# EAGLE board MainBoardSchematic (EAGLE 7.2.0)
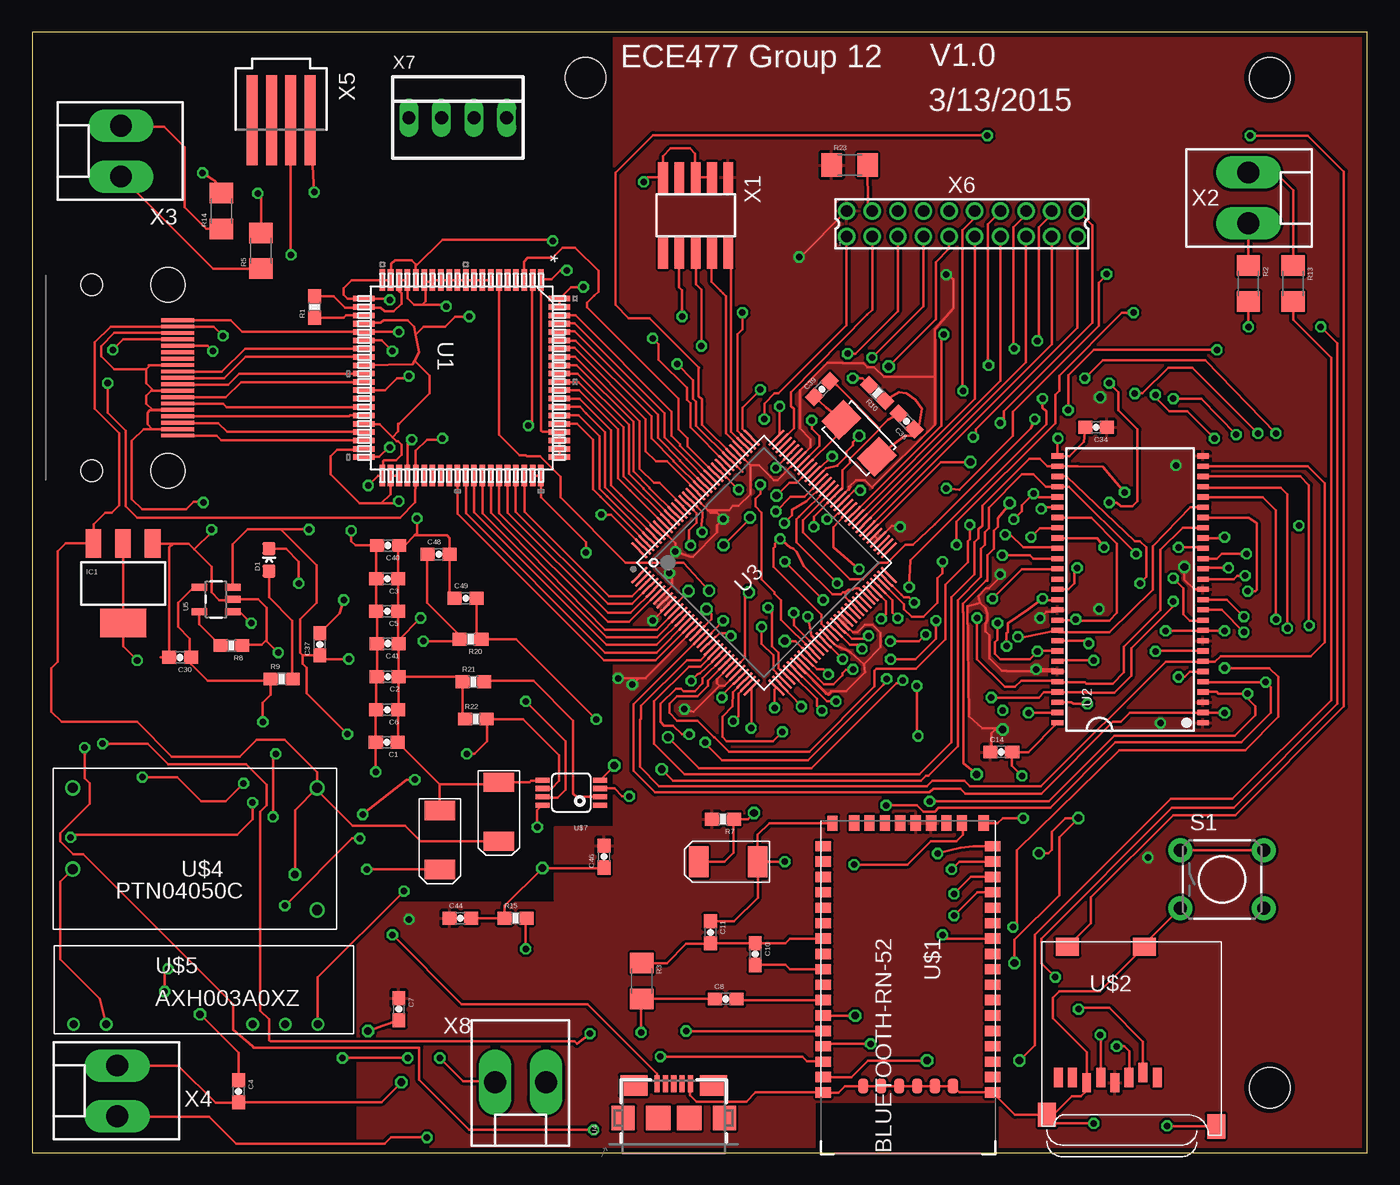
[diagram p5: board, top side]
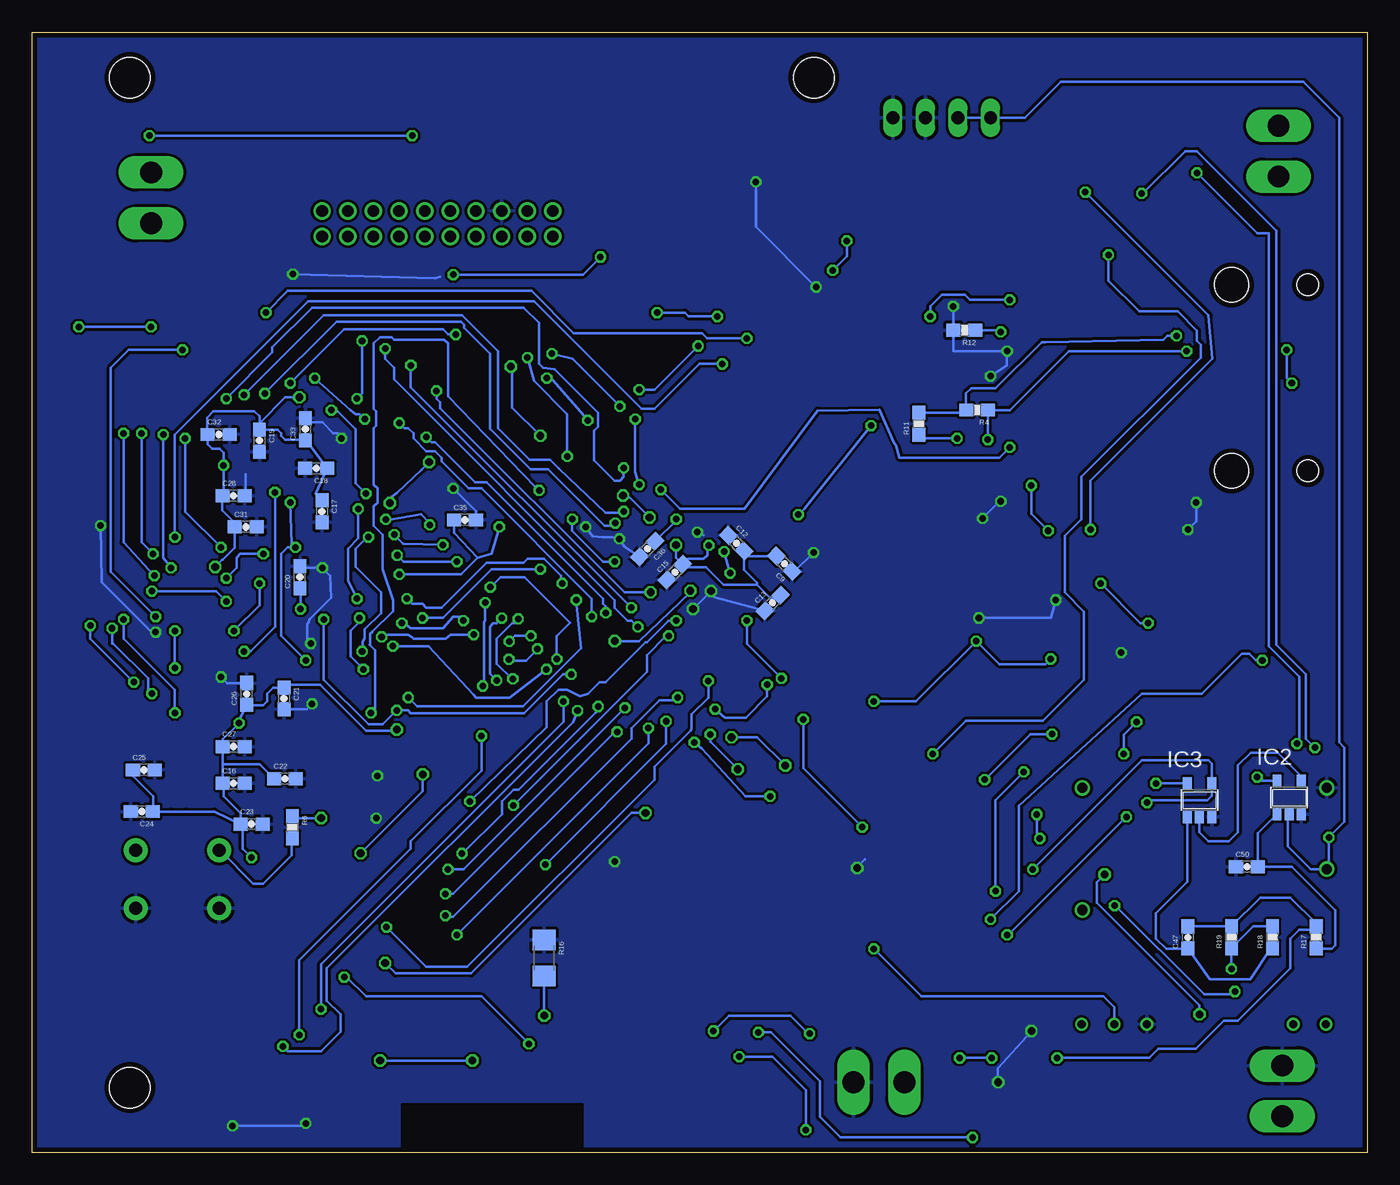
[diagram p6: board, bottom side, seen from below]

Size 104.14 x 87.38 mm. Coordinates in mm from the lower left corner, seen from the top.
Outline: 0,0 104.14,0 104.14,87.38 0,87.38 0,0
Copper layers (1*16): Top 0.0356mm / dielectric 1.5011mm / Bottom 0.0356mm
Design rules "ECE_Senior_Design": minimum track width 8mil, minimum drill 13mil, track to track 8mil, track to pad 8mil, pad to pad 6mil, via to via 8mil, smd to smd 6mil, copper to edge 15mil, drill to drill 8mil, minimum pad ring 7mil, minimum via ring 7mil, stop-mask expansion 3mil, vias tented up to drill 0mil, thermal gap 10mil
Holes 3.17 mm at 43.18,83.82 96.52,83.82 96.52,5.08
tRestrict: area 61.2,0 to 75.3,3.8
bRestrict: area 61.2,0 to 75.3,3.8

## Footprints (pad centres in the part's own frame; a part is rotated, then mirrored left to right if it is on the bottom)
0603-CAP = smd 1.1 x 1: 1 -0.85,0; 2 0.85,0
EIA6032 = smd 1.5 x 2.4: P$1 -2.3,0; P$2 2.3,0
LED-0603 = smd 1 x 1: A 0,-0.877; C 0,0.877
SOT223 = smd 1.219 x 2.235: 1 -2.311,-3.099; 2 0,-3.099; 3 2.311,-3.099 | smd 3.6 x 2.2: 4 0,3.099
SOT23-5 = smd 0.69 x 0.99: 1 -0.95,-1.29; 2 0,-1.29; 3 0.95,-1.29; 4 0.95,1.3; 5 -0.95,1.3
0603-RES = smd 1.1 x 1: 1 -0.85,0; 2 0.85,0
1206 = smd 1.6 x 1.8: 1 -1.4,0; 2 1.4,0
TACTILE-PTH = drill 1.016 pad 1.88: 1 -3.251,2.261; 2 3.251,2.261; 3 -3.251,-2.261; 4 3.251,-2.261
ST_80_2 = smd 1.676 x 0.432: 1 -7.62,6.172; 2 -7.62,5.537; 3 -7.62,4.877; 4 -7.62,4.216; 5 -7.62,3.581; 6 -7.62,2.921; 7 -7.62,2.286; 8 -7.62,1.626; 9 -7.62,0.965; 10 -7.62,0.33; 11 -7.62,-0.33; 12 -7.62,-0.965; 13 -7.62,-1.626; 14 -7.62,-2.286; 15 -7.62,-2.921; 16 -7.62,-3.581; 17 -7.62,-4.216; 18 -7.62,-4.877; 19 -7.62,-5.537; 20 -7.62,-6.172; 41 7.62,-6.172; 42 7.62,-5.537; 43 7.62,-4.877; 44 7.62,-4.216; 45 7.62,-3.581; 46 7.62,-2.921; 47 7.62,-2.286; 48 7.62,-1.626; 49 7.62,-0.965; 50 7.62,-0.33; 51 7.62,0.33; 52 7.62,0.965; 53 7.62,1.626; 54 7.62,2.286; 55 7.62,2.921; 56 7.62,3.581; 57 7.62,4.216; 58 7.62,4.877; 59 7.62,5.537; 60 7.62,6.172 | smd 0.432 x 1.676: 21 -6.172,-7.62; 22 -5.537,-7.62; 23 -4.877,-7.62; 24 -4.216,-7.62; 25 -3.581,-7.62; 26 -2.921,-7.62; 27 -2.286,-7.62; 28 -1.626,-7.62; 29 -0.965,-7.62; 30 -0.33,-7.62; 31 0.33,-7.62; 32 0.965,-7.62; 33 1.626,-7.62; 34 2.286,-7.62; 35 2.921,-7.62; 36 3.581,-7.62; 37 4.216,-7.62; 38 4.877,-7.62; 39 5.537,-7.62; 40 6.172,-7.62; 61 6.172,7.62; 62 5.537,7.62; 63 4.877,7.62; 64 4.216,7.62; 65 3.581,7.62; 66 2.921,7.62; 67 2.286,7.62; 68 1.626,7.62; 69 0.965,7.62; 70 0.33,7.62; 71 -0.33,7.62; 72 -0.965,7.62; 73 -1.626,7.62; 74 -2.286,7.62; 75 -2.921,7.62; 76 -3.581,7.62; 77 -4.216,7.62; 78 -4.877,7.62; 79 -5.537,7.62; 80 -6.172,7.62
TSOP54-400 = smd 0.4 x 0.9: 1 -10.4,-5.68; 2 -9.6,-5.68; 3 -8.8,-5.68; 4 -8,-5.68; 5 -7.2,-5.68; 6 -6.4,-5.68; 7 -5.6,-5.68; 8 -4.8,-5.68; 9 -4,-5.68; 10 -3.2,-5.68; 11 -2.4,-5.68; 12 -1.6,-5.68; 13 -0.8,-5.68; 14 0,-5.68; 15 0.8,-5.68; 16 1.6,-5.68; 17 2.4,-5.68; 18 3.2,-5.68; 19 4,-5.68; 20 4.8,-5.68; 21 5.6,-5.68; 22 6.4,-5.68; 23 7.2,-5.68; 24 8,-5.68; 25 8.8,-5.68; 26 9.6,-5.68; 27 10.4,-5.68; 28 10.4,5.68; 29 9.6,5.68; 30 8.8,5.68; 31 8,5.68; 32 7.2,5.68; 33 6.4,5.68; 34 5.6,5.68; 35 4.8,5.68; 36 4,5.68; 37 3.2,5.68; 38 2.4,5.68; 39 1.6,5.68; 40 0.8,5.68; 41 0,5.68; 42 -0.8,5.68; 43 -1.6,5.68; 44 -2.4,5.68; 45 -3.2,5.68; 46 -4,5.68; 47 -4.8,5.68; 48 -5.6,5.68; 49 -6.4,5.68; 50 -7.2,5.68; 51 -8,5.68; 52 -8.8,5.68; 53 -9.6,5.68; 54 -10.4,5.68
PDT0128A_N = smd 1.753 x 0.229: 1 -7.569,6.198; 2 -7.569,5.791; 3 -7.569,5.41; 4 -7.569,5.004; 5 -7.569,4.597; 6 -7.569,4.191; 7 -7.569,3.81; 8 -7.569,3.404; 9 -7.569,2.997; 10 -7.569,2.591; 11 -7.569,2.21; 12 -7.569,1.803; 13 -7.569,1.397; 14 -7.569,0.991; 15 -7.569,0.61; 16 -7.569,0.203; 17 -7.569,-0.203; 18 -7.569,-0.61; 19 -7.569,-0.991; 20 -7.569,-1.397; 21 -7.569,-1.803; 22 -7.569,-2.21; 23 -7.569,-2.591; 24 -7.569,-2.997; 25 -7.569,-3.404; 26 -7.569,-3.81; 27 -7.569,-4.191; 28 -7.569,-4.597; 29 -7.569,-5.004; 30 -7.569,-5.41; 31 -7.569,-5.791; 32 -7.569,-6.198; 65 7.569,-6.198; 66 7.569,-5.791; 67 7.569,-5.41; 68 7.569,-5.004; 69 7.569,-4.597; 70 7.569,-4.191; 71 7.569,-3.81; 72 7.569,-3.404; 73 7.569,-2.997; 74 7.569,-2.591; 75 7.569,-2.21; 76 7.569,-1.803; 77 7.569,-1.397; 78 7.569,-0.991; 79 7.569,-0.61; 80 7.569,-0.203; 81 7.569,0.203; 82 7.569,0.61; 83 7.569,0.991; 84 7.569,1.397; 85 7.569,1.803; 86 7.569,2.21; 87 7.569,2.591; 88 7.569,2.997; 89 7.569,3.404; 90 7.569,3.81; 91 7.569,4.191; 92 7.569,4.597; 93 7.569,5.004; 94 7.569,5.41; 95 7.569,5.791; 96 7.569,6.198 | smd 0.229 x 1.753: 33 -6.198,-7.569; 34 -5.791,-7.569; 35 -5.41,-7.569; 36 -5.004,-7.569; 37 -4.597,-7.569; 38 -4.191,-7.569; 39 -3.81,-7.569; 40 -3.404,-7.569; 41 -2.997,-7.569; 42 -2.591,-7.569; 43 -2.21,-7.569; 44 -1.803,-7.569; 45 -1.397,-7.569; 46 -0.991,-7.569; 47 -0.61,-7.569; 48 -0.203,-7.569; 49 0.203,-7.569; 50 0.61,-7.569; 51 0.991,-7.569; 52 1.397,-7.569; 53 1.803,-7.569; 54 2.21,-7.569; 55 2.591,-7.569; 56 2.997,-7.569; 57 3.404,-7.569; 58 3.81,-7.569; 59 4.191,-7.569; 60 4.597,-7.569; 61 5.004,-7.569; 62 5.41,-7.569; 63 5.791,-7.569; 64 6.198,-7.569; 97 6.198,7.569; 98 5.791,7.569; 99 5.41,7.569; 100 5.004,7.569; 101 4.597,7.569; 102 4.191,7.569; 103 3.81,7.569; 104 3.404,7.569; 105 2.997,7.569; 106 2.591,7.569; 107 2.21,7.569; 108 1.803,7.569; 109 1.397,7.569; 110 0.991,7.569; 111 0.61,7.569; 112 0.203,7.569; 113 -0.203,7.569; 114 -0.61,7.569; 115 -0.991,7.569; 116 -1.397,7.569; 117 -1.803,7.569; 118 -2.21,7.569; 119 -2.591,7.569; 120 -2.997,7.569; 121 -3.404,7.569; 122 -3.81,7.569; 123 -4.191,7.569; 124 -4.597,7.569; 125 -5.004,7.569; 126 -5.41,7.569; 127 -5.791,7.569; 128 -6.198,7.569
USB-AB-MICRO-SMD = smd 1.35 x 0.4: D+ 2.675,0; D- 2.675,0.65; GND 2.675,-1.3; ID 2.675,-0.65; VBUS 2.675,1.3 | smd 1.6 x 2.1: P$1 2.55,3.1; P$2 2.55,-3.1 | smd 1.9 x 1.9: P$6 0,1.2; P$7 0,-1.2 | smd 1.9 x 1.801: P$8 0,3.95; P$9 0,-3.95
SOT23-5' = smd 0.55 x 1.2: 1 -0.95,-1.3; 2 0,-1.3; 3 0.95,-1.3; 4 0.95,1.3; 5 -0.95,1.3
RN-52 = smd 1.2 x 0.8: 1 -6.6,8.33; 2 -6.6,7.13; 3 -6.6,5.93; 4 -6.6,4.73; 5 -6.6,3.53; 6 -6.6,2.33; 7 -6.6,1.13; 8 -6.6,-0.07; 9 -6.6,-1.27; 10 -6.6,-2.47; 11 -6.6,-3.67; 12 -6.6,-4.87; 13 -6.6,-6.07; 14 -6.6,-7.27; 15 -6.6,-8.47; 16 -6.6,-9.67; 25 6.6,-9.67; 26 6.6,-8.47; 27 6.6,-7.27; 28 6.6,-6.07; 29 6.6,-4.87; 30 6.6,-3.67; 31 6.6,-2.47; 32 6.6,-1.27; 33 6.6,-0.07; 34 6.6,1.13; 35 6.6,2.33; 36 6.6,3.53; 37 6.6,4.73; 38 6.6,5.93; 39 6.6,7.13; 40 6.6,8.33; G1 -6.6,9.53; G4 6.6,9.53 | smd 0.8 x 1.2: 17 -4.2,-11.47; 18 -3,-11.47; 19 -1.8,-11.47; 20 -0.6,-11.47; 21 0.6,-11.47; 22 1.8,-11.47; 23 3,-11.47; 24 4.2,-11.47; G2 -5.9,-11.47; G3 5.9,-11.46; RFG1 -3.5,9.03; RFG2 -2.1,9.03; RFG3 -0.7,9.03; RFG4 0.7,9.03; RFG5 2.1,9.03; RFG6 3.5,9.03
MICROSD = smd 0.7 x 1.5: 1 9,-10.64; 2 7.9,-10.24; 3 6.8,-10.64; 4 5.7,-11.04; 5 4.6,-10.64; 6 3.5,-11.04; 7 2.4,-10.64; 8 1.3,-10.64 | smd 1.8 x 1.4: CD1 2,-0.44; CD2 8,-0.44 | smd 1.4 x 1.9: MT1 0.4,-13.54; MT2 13.6,-14.44
HDMI_A_SMD = smd 0.3 x 2.6: P$1 4.5,3.74; P$2 4,3.74; P$3 3.5,3.74; P$4 3,3.74; P$5 2.5,3.74; P$6 2,3.74; P$7 1.5,3.74; P$8 1,3.74; P$9 0.5,3.74; P$10 0,3.74; P$11 -0.5,3.74; P$12 -1,3.74; P$13 -1.5,3.74; P$14 -2,3.74; P$15 -2.5,3.74; P$16 -3,3.74; P$17 -3.5,3.74; P$18 -4,3.74; P$19 -4.5,3.74 | hole 2.7: -7.25,2.98; 7.25,2.98 | hole 1.7: -7.25,-2.98; 7.25,-2.98
PTN04050C = drill 0.8: P$1 -9.53,4.76; P$2 9.53,4.76; P$3 9.53,-4.76; P$4 -9.53,-1.58
AXH003A0XZ = drill 0.635: P$1 -10.16,-2.667; P$2 -7.62,-2.667; P$3 3.81,-2.667; P$4 6.35,-2.667; P$5 8.89,-2.667
MSOP8 = smd 0.4 x 1.1: 1 -0.975,-2.25; 2 -0.325,-2.25; 3 0.325,-2.25; 4 0.975,-2.25; 5 0.975,2.25; 6 0.325,2.25; 7 -0.325,2.25; 8 -0.975,2.25
1365-10 = smd 0.76 x 2.4: 1 -2.54,-2.95; 2 -2.54,2.95; 3 -1.27,-2.95; 4 -1.27,2.95; 5 0,-2.95; 6 0,2.95; 7 1.27,-2.95; 8 1.27,2.95; 9 2.54,-2.95; 10 2.54,2.95
KK-156-2 = drill 1.7 pad 2.184 long: 1 -1.98,0; 2 1.98,0
87438-04 = smd 7 x 0.85: 1 0,2.25; 2 0,0.75; 3 0,-0.75; 4 0,-2.25
87758-2016 = drill 0.9 pad 1.27: 1 -9,-1; 2 -9,1; 3 -7,-1; 4 -7,1; 5 -5,-1; 6 -5,1; 7 -3,-1; 8 -3,1; 9 -1,-1; 10 -1,1; 11 1,-1; 12 1,1; 13 3,-1; 14 3,1; 15 5,-1; 16 5,1; 17 7,-1; 18 7,1; 19 9,-1; 20 9,1
22-23-2041 = drill 1 long: 1 -3.81,0; 2 -1.27,0; 3 1.27,0; 4 3.81,0
NX5032GA = smd 2 x 2.4: P$1 -2,0; P$2 2,0

## Placement (x,y rotation side)
C1  .1uF  [0603-CAP]  27.66,32.02 180 top
C2  .1uF  [0603-CAP]  27.74,37.12 180 top
C3  .1uF  [0603-CAP]  27.7,44.75 180 top
C4  10uF  [0603-CAP]  16.1,4.8 270 top
C5  .1uF  [0603-CAP]  27.69,42.23 180 top
C6  .1uF  [0603-CAP]  27.69,34.54 180 top
C7  10uF  [0603-CAP]  28.6,11.2 270 top
C8  47 nF  [0603-CAP]  54.1,12 0 top
C9  0.01 uF  [0603-CAP]  45.48,45.93 135 bottom
C10  47 nF  [0603-CAP]  56.4,15.5 270 top
C11  1uF  [0603-CAP]  52.9,17.2 270 top
C12  0.1 uF  [0603-CAP]  49.22,47.53 315 bottom
C13  1 uF  [0603-CAP]  46.39,42.88 45 bottom
C14  0.1uF  [0603-CAP]  75.58,31.25 0 top
C15  2.2 uF  [0603-CAP]  54.01,45.28 45 bottom
C16  0.1uF  [0603-CAP]  88.42,28.81 0 bottom
C17  0.01uF  [0603-CAP]  81.53,50.02 270 bottom
C18  0.01uF  [0603-CAP]  81.98,53.37 180 bottom
C19  0.1uF  [0603-CAP]  86.41,55.52 270 bottom
C20  0.1uF  [0603-CAP]  83.25,44.88 90 bottom
C21  0.1uF  [0603-CAP]  84.49,35.42 270 bottom
C22  0.1uF  [0603-CAP]  84.42,29.17 0 bottom
C23  0.1uF  [0603-CAP]  87.02,25.63 0 bottom
C24  0.1uF  [0603-CAP]  95.58,26.61 180 bottom
C25  0.1uF  [0603-CAP]  95.42,29.85 0 bottom
C26  0.1uF  [0603-CAP]  87.41,35.78 90 bottom
C27  0.01uF  [0603-CAP]  88.42,31.67 0 bottom
C28  0.1uF  [0603-CAP]  88.42,51.23 0 bottom
C29  10nF  [EIA6032]  54.29,22.69 0 top
C30  4.7uF  [0603-CAP]  11.55,38.63 180 top
C31  2.2 uF  [0603-CAP]  87.48,48.8 0 bottom
C32  2.2 uF  [0603-CAP]  89.58,56.01 0 bottom
C33  2.2 uF  [0603-CAP]  82.82,56.42 90 bottom
C34  2.2 uF  [0603-CAP]  82.98,56.57 180 top
C35  2.2 uF  [0603-CAP]  70.38,49.34 0 bottom
C36  2.2 uF  [0603-CAP]  56.15,47.08 225 bottom
C37  4.7uF  [0603-CAP]  22.44,39.65 90 top
C38  12pF  [0603-CAP]  68.19,57.02 135 top
C39  12pF  [0603-CAP]  61.6,59.54 45 top
C40  .1uF  [0603-CAP]  27.76,47.35 180 top
C41  .1uF  [0603-CAP]  27.74,39.7 180 top
C42  100 uF  [EIA6032]  31.8,24.4 90 top
C43  100 uF  [EIA6032]  36.4,26.6 90 top
C44  .1uF  [0603-CAP]  33.4,18.3 0 top
C46  4.7uF  [0603-CAP]  44.6,23.1 90 top
C47  1uF  [0603-CAP]  14,16.8 90 bottom
C48  1uF  [0603-CAP]  31.71,46.66 0 top
C49  220nF  [0603-CAP]  33.81,43.24 0 top
C50  1uF  [0603-CAP]  9.4,22.3 0 bottom
D1  RED  [LED-0603]  18.48,46.23 0 top
IC1  V_REG_LM1117SOT223  [SOT223]  7.1,44.4 180 top
IC2  NAND  [SOT23-5]  6.1,27.7 0 bottom
IC3  NAND  [SOT23-5]  13.1,27.5 0 bottom
R1  887  [0603-RES]  22.04,65.94 90 top
R2  8  [1206]  94.86,67.77 270 top
R3  2.2K  [1206]  47.55,13.4 270 top
R4  2k  [0603-RES]  30.44,57.92 180 bottom
R5  8  [1206]  17.85,70.33 90 top
R6  470  [0603-RES]  83.84,25.38 270 bottom
R7  10k  [0603-RES]  53.88,26.02 180 top
R8  10k  [0603-RES]  15.55,39.55 180 top
R9  10k  [0603-RES]  19.46,36.94 0 top
R10  750  [0603-RES]  65.91,59.24 135 top
R11  2k  [0603-RES]  34.99,56.84 90 bottom
R12  10k  [0603-RES]  31.44,64.13 180 bottom
R13  8  [1206]  98.34,67.77 270 top
R14  8  [1206]  14.77,73.43 90 top
R15  15k  [0603-RES]  37.7,18.3 0 top
R16  0  [1206]  64.2,15.2 270 bottom
R17  5M  [0603-RES]  4,16.8 90 bottom
R18  100k  [0603-RES]  7.4,16.8 90 bottom
R19  100k  [0603-RES]  10.6,16.8 90 bottom
R20  1k  [0603-RES]  34.19,40.05 180 top
R21  200k  [0603-RES]  34.41,36.73 0 top
R22  33m  [0603-RES]  34.61,33.82 0 top
R23  8  [1206]  63.76,77.01 0 top
S1  [TACTILE-PTH]  92.8,21.32 0 top
U1  HDMI TX  [ST_80_2]  33.5,60.42 270 top
U2  SDRAM  [TSOP54-400]  85.64,43.93 90 top
U3  Cortex M4  [PDT0128A_N]  57.09,46.01 45 top
U4  [USB-AB-MICRO-SMD]  50.04,2.71 90 top
U5  MCP73831  [SOT23-5']  14.35,43.15 90 top
U$1  BLUETOOTH-RN-52  [RN-52]  68.31,14.24 180 top
U$2  MICROSD  [MICROSD]  78.74,16.51 0 top
U$3  HDMI_A  [HDMI_A_SMD]  7.62,60.42 270 top
U$4  PTN04050C  [PTN04050C]  12.7,23.7 0 top
U$5  AXH003A0XZ  [AXH003A0XZ]  13.4,12.7 0 top
U$7  STC3100  [MSOP8]  42.05,28.08 90 top
X1  Cortex 10  [1365-10]  51.75,73.09 180 top
X2  [KK-156-2]  94.86,74.45 270 top
X3  [KK-156-2]  6.94,78.09 90 top
X4  [KK-156-2]  6.64,4.83 90 top
X5  87438-04  [87438-04]  19.43,80.5 270 top
X6  Camera HDR  [87758-2016]  72.52,72.43 0 top
X7  22-23-2041  [22-23-2041]  33.2,80.7 0 top
X8  [KK-156-2]  38.1,5.5 180 top
Y1  [NX5032GA]  64.49,55.71 133.9 top

## Tracks (layer width: path | path; a pad name or v marks a point on that pad's centre or on a via)
1.8V  (via drill 0.51 pad 0.25)
  Top 0.203: U1.29 29.68,61.48 29.84,61.76 | 29.84,61.76 30.2,62.4 29.92,63.78 | 29.92,63.78 29.8,64.4 29.3,64.9 27.4,64.9 27.2,64.7 25.94,64.7 U1.24 | v40.6,71.1 40.5,71.2 32,71.2 29.92,69.12 U1.16 29.92,69.28 29.6,69.6 28.3,69.6 28,69.3 28,68.08 U1.19 U1.20 24.94,68.04 24.3,67.4 24.3,66.9 24.6,66.6 U1.21 27.81,66.59 v27.9,66.5 | v41.7,68.8 41.2,68.8 40.5,68.1 39.73,68.1 U1.1 39.7,68.01 39.7,56.3 39.8,56.2 U1.64 U1.63 U1.62 U1.61 | v34.1,65.2 33,65.2 32.2,64.4 30.54,64.4 29.92,63.78 | v26.22,52.03 26.99,52.8 U1.41 27.38,52.85 27.38,53.92 27.47,54.01 28.4,54.01 28.8,54.41 28.8,55.2 28.54,55.46 28.44,55.46 28.1,55.8 | v24.89,48.5 24.89,47.7 25.23,47.36 C40.2 26.85,47.29 C3.2 C5.2 26.89,42.18 C41.2 C2.2 26.84,37.07 C6.2 26.81,34.51 C1.2 v26.8,29.7 | U$5.P$5 22.29,13.69 v29,20.4 | 29.84,61.76 31,60.6 31,59.2 28.64,56.84 28.54,56.84 28.54,56.24 28.1,55.8 | 28.1,55.8 27.1,56.8 25.92,56.8 U1.36
  Bottom 0.203: v40.6,71.1 40.6,69.9 v41.7,68.8 | v27.9,66.5 31,66.5 31.4,66.9 33.2,66.9 34.1,66 v34.1,65.2 | v26.22,52.03 26.22,49.83 v24.89,48.5 | v29,20.4 29,27.5 v26.8,29.7
3.3V  (via drill 0.51, 0.51 pad 0.25, 0.6)
  Top 0.203: 91.35,33.5 U2.1 91.29,33.5 | IC1.2 IC1.4 7.1,39.5 v8.2,38.4 | 32.45,18.2 C44.1 | U3.9 49.62,42.72 v48.4,41.5 | 49.04,48.66 U3.122 49.05,48.67 50.19,47.53 50.19,46.89 v50.17,46.87 51.36,46.48 51.53,46.48 53.43,48.38 53.43,48.93 v53.9,49.4 53.4,49.9 52.9,49.9 51.59,51.21 U3.113 52.72,50.1 54.34,50.1 54.67,50.43 55.1,50.43 56.01,51.34 56.01,53.59 | U3.101 56.01,53.59 | U3.69 U3.68 67.06,48.9 v67.7,48.8 | R7.2 53.03,25.63 | 54.4,37.96 U3.26 53.4,36.93 53.4,36.6 53.6,36.4 | 44.55,24 C46.2 | v89.86,45.68 89.86,44.69 90.62,43.93 U2.14 | C14.1 74.8,31.32 74.8,32.7 75.1,33 v75.7,33 75.61,33.09 74.11,33.09 73.05,34.05 72.95,42.6 73.74,42.79 73.9,42.89 | U3.28 54.99,37.39 54,36.4 53.6,36.4 | U3.7 49.05,43.35 49.9,44.2 49.9,45 v49.7,45.2 | v45.7,37 47.79,37 U3.16 51.59,40.76 47.84,37.01 47.32,37.01 v46.81,36.5 | v50.88,34.6 51.6,34.4 53.6,36.4 | 56.01,53.59 56.71,53.59 57.58,52.72 57.58,52.71 57.87,52.42 58.11,52.42 U3.90 60.71,55.02 60.71,55.65 59.88,56.48 59.88,59.45 62.02,61.59 63.2,61.59 63.23,61.56 64.84,61.56 65.14,61.26 65.67,61.26 66.44,60.49 70.3,60.49 70.39,60.4 | 64.86,38.09 64.96,37.47 63.46,35.97 62.34,35.97 62.18,35.81 61.92,35.81 59.77,37.96 U3.39 59.84,37.96 62.1,35.7 62.1,35.8 62.3,36 | 64.86,38.09 63.81,39.04 63.64,39.14 63.46,39.22 62.72,39.52 U3.47 | U2.43 79.93,42.33 79.8,42.2 79.1,42.2 v78.6,41.7 | v78.3,37.7 79.79,37.7 U2.49 76.07,37.53 76,37.6 75.63,37.6 74.67,38.56 74.67,40.36 74.36,40.67 74.36,41.26 74.52,41.52 74.52,42.02 74.35,42.49 73.9,42.89 | v75.5,45.1 75.5,44.9 74.6,44 74.4,44 73.8,43.4 73.9,42.89 | U3.51 63.24,41.36 64,40.6 64.38,40.6 64.97,41.19 65.54,41.19 66.18,40.55 66.18,39.41 64.86,38.09
  Top 0.203: U3.79 63.84,51.93 63.72,51.71 63.72,51.93 64.24,52.45 64.95,52.45 65.55,51.85 65.55,51.94 70.39,56.78 70.39,60.4 | 70.39,60.4 70.39,64.19 71.85,65.85 71.85,68.11 v71.3,68.46 | v59.81,69.84 59.93,69.84 X6.2
  Bottom 0.203: 86.41,56.9 C19.1 84.97,56.37 84.7,56.1 84.7,55.9 84.4,55.6 82.85,55.6 C33.1 82.63,55.38 C18.1 82.03,51.37 C17.1 | 86.41,56.9 86.41,57.41 86.8,57.8 90,57.8 90.5,57.3 90.5,56.08 C32.1 90.43,55.23 90.1,54.9 89.5,54.9 89.2,54.6 v89.2,53.6 89.2,51.3 C28.1 89.3,51.2 89.3,50.1 88.33,49.13 C31.1 88.33,47.18 89.28,46.23 89.31,46.23 v89.86,45.68 | 89.27,30.3 C27.1 89.27,32.23 v88,33.5 88.07,33.57 C26.1 87.38,34.9 86.1,34.9 85.8,35.2 85.8,35.8 85.33,36.27 C21.1 84.28,36.48 81.68,36.48 78.1,32.9 75.8,32.9 v75.7,33 | 89.27,30.3 C16.1 89.2,28.74 89.2,27.8 87.87,26.47 C23.1 | C25.1 96.27,29.37 94.7,27.8 94.7,26.64 C24.1 93.29,26.61 92.1,26.6 89.9,26.6 C23.1 | C22.1 86.4,30.3 89.27,30.3 | C20.1 83.2,43.08 v83.2,42.4 | C23.1 87.7,25.46 87.7,23.7 v87.03,23.03 | v53.9,49.4 53.9,49.33 C36.1 | C35.1 71.23,48.33 69.4,46.4 | 69.4,46.4 68.3,46.7 v67.7,48.8 | v83.3,58.9 84.41,58.9 86.41,56.9 | v49.7,45.2 50.1,46.6 v50.17,46.87 | v48.4,41.5 48.4,39.7 v45.7,37 | v46.81,36.5 46.81,35.58 48.48,33.91 50.09,33.91 v50.88,34.6 | v78.3,37.7 79.3,38.7 79.3,40.7 78.6,41.4 v78.6,41.7 | v71.3,68.46 61.19,68.46 v59.81,69.84 | v8.2,38.4 8.7,38.4 9.2,38.9 9.8,38.9 12.9,35.8 17.6,35.8 27.19,27.05 27.19,20.41 v29.4,18.2 | v75.5,45.1 70.7,45.1 69.4,46.4
  pour Top: 25.4,0 25.4,19.5 40.8,19.5 40.8,25.4 40.9,25.4 45.4,25.4 45.4,87.3 104.1,87.3 104.1,0
3.7V  (via drill 0.51 pad 0.25)
  Top 0.203: U$5.P$2 5.28,12.02 2.2,15.1 2.2,21.15 U$4.P$4 | v26.1,22.1 C42.P$1 | v17.2,27.3 17.2,26 16,24.8 3.2,24.8 v3,24.6
  Bottom 0.203: IC2.2 6.2,26.31 6.2,23.9 4.42,22.12 U$4.P$4 3,22.29 v3,24.6 1.8,25.8 1.8,31.6 2.2,32 2.2,80.7 5,83.5 23.9,83.5 26.7,80.7 X7.1 X7.2 | v26.1,22.1 17.6,30.6 12.4,30.6 12.15,30.35 IC3.4 12.15,27.85 12.5,27.5 17,27.5 v17.2,27.3
5V  (via drill 0.51 pad 0.25, 0.6)
  Top 0.203: IC1.3 4.8,49 5.7,49.9 6.2,49.9 6.8,50.5 6.8,56.1 4.9,58 4.9,63.18 6.14,64.42 U$3.P$18 14.18,64.42 v14.9,63.7 | IC1.3 | U$4.P$2 22.23,29.67 19.7,32.2 17.5,32.2 16.2,30.9 10.9,30.9 8.2,33.6 2.3,33.6 1.5,34.4 1.5,37.8 2,38.3 2,46.9 2.61,47.51 IC1.3 | C4.1 16.1,7.8 v13.1,10.8 | v20.5,21.7 20.5,26.73 U$4.P$2 | U$4.P$2 22.23,28.27 25,25.5 29.1,25.5 30.3,24.3 C43.P$1
  Bottom 0.203: R11.2 31.52,57.69 R4.2 31.3,59.2 30.9,59.6 29,59.6 25.4,63.2 25.1,63.2 15.9,63.4 15.6,63.7 v14.9,63.7 | v13.1,10.8 13.1,11.5 21.1,19.5 21.1,21.1 v20.5,21.7
BT_GPIO7  (via drill 0.51)
  Top 0.203: U3.31 55.83,36.53 55.8,36.53 55.08,35.81 55.08,34.04 v54.69,33.65 | U$1.17 72.6,25.62 72.6,24.8 72.1,24.3 70.1,24.3 68.27,22.47 v64.1,22.47
  Bottom 0.203: v54.69,33.65 54.69,31.88 v64.1,22.47
BT_GPIO9  (via drill 0.51)
  Top 0.203: U$1.10 71.29,16.71 v71,17 | U3.32 56.12,33.17 v56.07,33.12
  Bottom 0.203: v56.07,33.12 56.07,31.93 v71,17
BT_UART_CTS  (via drill 0.51, 0.51 pad 0.25)
  Top 0.203: U$1.14 73.21,21.51 v71.9,20.2 | v58.52,32.83 57.79,32.1 54.16,32.1 53.83,32.43 53.83,33.99 54.64,34.8 54.65,35.91 55.57,36.83 U3.30
  Bottom 0.203: v71.9,20.2 71.3,20.2 58.67,32.83 v58.52,32.83
BT_UART_RTS  (via drill 0.51)
  Top 0.203: U$1.13 73.71,20.31 v71.9,18.5 | U3.29 55.17,37.04 53.89,35.76 v53.8,35.5
  Bottom 0.203: v53.8,35.5 54,35.3 55.2,35.3 57.4,33.1 57.4,32.3 71.3,18.4 71.8,18.4 v71.9,18.5
BT_UART_RX  (via drill 0.51)
  Top 0.203: U3.34 58.34,36.56 v59.99,34.8 | v70.62,23.34 72.4,23.8 73.4,23.9 U$1.16
  Bottom 0.203: v70.62,23.34 70.56,23.34 67.5,26.4 67.5,27.4 66.6,28.3 66.2,28.3 60.2,34.3 60,34.59 v59.99,34.8
BT_UART_TX  (via drill 0.51)
  Top 0.203: U$1.15 72.31,22.71 v71.7,22.1 | v57.9,34.7 57.9,36.12 U3.33
  Bottom 0.203: v71.7,22.1 70.5,22.1 v57.9,34.7
CAM_CLK  (via drill 0.51 pad 0.25)
  Top 0.203: X6.1 63.52,64.52 58.2,59.2 57.9,59.2 57.1,58.4 v57.1,57.2 | U3.43 58.4,41.58 58.4,43.1 57.9,43.6 57.9,43.7 56.89,44.71 56.89,49.92 56.4,50.41 56.4,51 56.8,51.4 v56.8,52.1
  Bottom 0.203: v57.1,57.2 57.1,53.1 v56.8,52.1
CAM_D0
  Top 0.203: X6.13 75.52,60.2 U3.73
CAM_D1
  Top 0.203: X6.15 77.52,61.63 U3.72
CAM_D2
  Top 0.203: X6.17 79.52,63.05 U3.71
CAM_D3  (via drill 0.51)
  Top 0.203: X6.19 81.52,64.32 73.6,56.4 73.6,56 v73.4,55.8 | U3.44 59.4,41.15 v59.4,42.1
  Bottom 0.203: v59.4,42.1 59.4,42.6 59.6,42.8 59.6,43.2 68.7,52.3 69.6,52.3 72.7,55.4 73,55.4 v73.4,55.8
CAM_D4  (via drill 0.51)
  Top 0.203: X6.20 81.57,73.43 82.7,72.3 82.7,64.7 75.8,57.8 75.8,57.2 v75.5,56.9 | v60.5,41.8 60.8,40.32 U3.45
  Bottom 0.203: v60.5,41.8 60.5,43.2 69.1,51.8 70.1,51.8 72.2,53.9 72.2,54.2 72.7,54.7 73.4,54.7 74.4,55.7 74.4,56.1 74.8,56.5 75.1,56.5 v75.5,56.9
CAM_D5  (via drill 0.51)
  Top 0.203: X6.18 79.52,73.12 79.48,73.12 78.52,72.16 78.52,63.42 v78.4,63.3 | U3.46 63.11,38.59 v63.21,38.49 | v68.4,44.1 68.5,46.2 79.1,56.8 79.1,57.8 78.8,58.1 v78.8,58.8
  Bottom 0.203: v63.21,38.49 63.22,38.6 63.22,40.27 62.17,41.32 65.73,44.88 67.62,44.88 v68.4,44.1 | v78.4,63.3 78.4,59.2 v78.8,58.8
CAM_D6  (via drill 0.51)
  Top 0.203: X6.16 77.52,73.12 77.5,73.12 76.53,72.15 76.53,62.77 v76.6,62.7 | U3.35 57.8,37.65 57.8,38.8 56.9,39.7 v56.9,41
  Bottom 0.203: v56.9,41 57.4,41.5 57.7,41.5 58.7,42.5 58.7,43.1 75.9,60.3 75.9,61.2 76.6,61.9 v76.6,62.7
CAM_D7  (via drill 0.51)
  Top 0.203: X6.14 75.52,73.32 75.48,73.32 74.55,72.39 74.55,61.45 v74.6,61.4 | U3.36 58.88,37.12 58.2,37.8 58.2,39 57.7,39.5 57.7,42.2 v57.4,42.5
  Bottom 0.203: v74.6,61.4 74.6,59.7 v57.4,42.5
CAM_HSYNC  (via drill 0.6)
  Top 0.203: U3.85 61.9,53.37 62.81,53.57 62.81,53.61 63.5,54.3 63.5,54.66 64,55.16 64,55.4 v64.5,55.9 | X6.9 71.52,70.47 70.5,69.45 70.5,65 v66.8,61.3
  Bottom 0.203: v64.5,55.9 66.7,58.1 66.7,61.2 v66.8,61.3
CAM_PCLK
  Top 0.203: X6.11 73.52,58.78 U3.74
CAM_PWDWN  (via drill 0.51, 0.6)
  Top 0.203: X6.12 73.52,72.91 72.55,71.94 72.55,59.45 v72.6,59.4 | U3.27 54.7,37.7 55.6,38.6 55.6,43.4 v55.9,43.7
  Bottom 0.203: v72.6,59.4 72.6,58.8 72.31,58.51 72.31,58.06 57.95,43.7 v55.9,43.7
CAM_SCL
  Top 0.203: U3.95 59.4,56.51 59.4,58 59.2,58.2 59.2,59.3 65.12,65.32 65.52,65.72 X6.3
CAM_SDA  (via drill 0.51)
  Top 0.203: X6.5 67.52,65.62 64.2,62.3 v63.6,62.3 | v58.3,58.2 58.3,55.98 U3.96
  Bottom 0.203: v63.6,62.3 62,61.9 v58.3,58.2
CAM_VSYNC  (via drill 0.51)
  Top 0.203: X6.7 69.52,66.02 v65.5,62 | v62.4,54.3 62.05,54 U3.86
  Bottom 0.203: v65.5,62 65,60.2 62.4,57.6 v62.4,54.3
DDCSCL  (via drill 0.51, 0.51 pad 0.25)
  Top 0.203: U1.44 29.28,55.28 v29.6,55.6 | U$3.P$15 13.68,62.92 v14.1,62.5
  Bottom 0.203: v29.6,55.6 R4.1 29.57,57.9 27.9,57.9 23.3,62.5 v14.1,62.5
DDCSDA  (via drill 0.51, 0.51 pad 0.25)
  Top 0.203: v32,55.7 31.9,55.6 30.8,55.6 29.92,54.72 U1.45 29.9,52.78 29.89,50.73 28.69,49.53 9.6,49.5 8.19,49.5 7.29,50.4 7.29,56.31 5.9,57.7 v5.9,60 | U$3.P$16 7.12,63.42 v6.3,62.6
  Bottom 0.203: v32,55.7 34.7,55.7 R11.1 | v6.3,62.6 6.3,60.4 v5.9,60
GAUGE_SCL  (via drill 0.51, 0.6)
  Top 0.203: U3.61 66,44.2 67.1,43.1 67.1,42.09 v67.51,41.68 | U$7.4 45.4,30.16 v45.4,30.2 | v49.6,32.4 52,30 60.8,30 67.4,36.6 67.66,36.6 v67.9,36.84
  Bottom 0.203: v49.6,32.4 47.6,32.4 v45.4,30.2 | v67.51,41.68 67.92,41.27 68.18,41.27 68.43,41.02 68.43,37.37 v67.9,36.84
GAUGE_SDA  (via drill 0.51, 0.51 pad 0.25)
  Top 0.203: U3.60 66.6,43 66.6,42 v66.23,41.63 | v66.65,36.96 66.4,36.5 60.5,30.6 53.8,30.6 52.5,31.9 v52.5,32 | v46.58,27.8 46.02,27.8 45.41,28.41 U$7.3
  Bottom 0.203: v52.5,32 51.9,31.5 48.5,27.8 v46.58,27.8 | v66.23,41.63 66.56,41.3 66.7,41.3 67.9,40.1 67.9,38.15 66.71,36.96 v66.65,36.96
GND  (via drill 0.51, 0.51 pad 0.25, 0.6)
  Top 0.203: U$2.MT1 76.65,2.97 U$1.G1 72.31,4.71 U$1.RFG1 U$1.RFG2 U$1.RFG3 U$1.RFG4 U$1.RFG5 U$1.RFG6 63.41,5.21 62.9,4.7 U$1.G4 | U$1.G4 61.91,4.71 | U$2.MT1 79.74,2.97 | X1.3 X1.5 51.7,76.09 51.7,77.9 51.3,78.3 49.8,78.3 49.21,77.71 X1.9 48.04,76.04 v47.7,75.7 | U1.79 U1.80 42.03,67.5 v43,67.5 | 62.2,25.91 U$1.G3 57.5,25.7 56.59,24.79 C29.P$2 | C29.P$2 v58.69,22.69 v58.7,22.7 | U$1.G4 56.41,4.71 55.7,4 51.8,4 51.3,4.5 51.3,5.34 U4.GND | C39.2 62.76,59.84 66.1,56.5 | U3.80 63.2,51.83 63.2,53.2 63.8,53.8 63.8,54.1 66.1,56.4 66.1,56.5 | C38.2 66.76,57.16 66.1,56.5 | v81.5,45.6 81.3,45.3 81.3,44.4 80.83,43.93 U2.41 | v43.2,46.8 43.2,47.6 39.7,51.1 39.7,52.77 U1.60 U1.59 | v52.25,48.39 52.21,49 52.3,49.6 52.3,49.94 U3.114 | R1.2 23.51,66.79 24.4,65.9 25.82,65.9 | 25.82,65.9 U1.22 | 30.4,66.1 29.8,66.1 29.28,66.62 U1.17 U1.18 28.6,68.02 28.6,67.2 28.8,67 28.8,66.2 28.2,65.6 27.5,65.6 27.2,65.9 25.82,65.9 | 30.4,66.1 30.7,66.4 30.7,67.92 | 30.7,67.92 U1.15 | 30.4,66.1 32.2,66.1 v32.3,66 | 30.7,67.92 31.09,67.92 U1.14 U1.13 U1.12 U1.11 U1.10 U1.9 U1.8 U1.7 | v80,55.7 79.96,55.66 U2.28 79.99,54.3 80.9,54.3 82.03,55.43 C34.2 | v89.4,37.1 89.9,37.1 90.3,37.5 91.29,37.5 U2.6 | S1.3 86.74,16.25 U$2.CD2 83.27,12.6 80.1,12.6 79.6,12.1 79.6,10.5 82.24,7.86 U$2.6 82.24,4.84 81.8,4.4 81.1,4.4 79.7,3 | U2.46 82.19,39.93 v82.41,39.71 | v82.3,35 81.2,35 81.05,35.15 79.98,35.15 U2.52 80.97,35.13 | C2.1 C41.1 28.54,39.75 28.54,39.94 | C2.1 28.59,34.59 C6.1 28.54,32.05 C1.1 | C2.1 33.17,37.12 R21.1 33.56,34.02 R22.1 | 28.54,39.94 C5.1 C3.1 28.55,47.29 C40.1 29.05,47.35 29.83,48.13 | 29.83,48.13 32.36,48.13 32.58,47.91 32.58,46.68 C48.2 32.56,43.64 C49.1
  Top 0.203: U1.43 U1.42 27.96,51.36 27.23,50.63 | U1.26 27.26,63.34 v28.1,62.5 | U1.32 25.89,59.47 27.52,59.47 28.45,60.4 29.25,60.4 v29.4,60.55 | 27.23,50.63 25.56,50.63 23.29,52.9 23.29,54.3 23.8,54.81 25.81,54.81 U1.39 | 27.23,50.63 28.43,50.63 v28.6,50.8 | v30.02,49.47 30.02,48.32 29.83,48.13 | IC1.1 11,47.5 | 11,47.5 12.2,47.5 12.66,47.04 | 12.66,47.04 14,45.7 14,43.7 14.6,43.1 15.6,43.1 U5.2 17.65,43.15 18.3,42.5 18.3,40 | 18.3,40 17.9,39.6 16.45,39.6 R8.1 | 10.03,38.63 C30.2 10.7,47.2 11,47.5 | C1.1 | C42.P$2 31.8,28.73 | 31.8,28.73 C1.1 | C44.2 R15.1 36.85,19.25 v39.8,22.2 44.55,22.2 C46.1 | 28.54,39.94 v30.3,41.7 | v24.3,43.1 24,42.06 C37.2 | 18.3,40 18.3,39.9 v19.2,39 | 8.9,61.1 8.9,60 9.48,59.42 U$3.P$8 11.34,59.4 9.3,59.4 8.92,59.02 8.92,58.4 9.4,57.92 U$3.P$5 11.34,57.9 9.19,57.9 9,57.71 9,56.8 9.38,56.42 U$3.P$2 8.71,56.42 7.79,55.5 7.79,50.95 8.58,50.16 12.01,50.16 12.6,50.75 13.3,50.75 v13.35,50.7 | 8.9,61.1 9.2,61.4 11.34,61.4 U$3.P$12 9.08,61.42 | 11.31,63.97 U$3.P$17 6.42,63.92 5.4,62.9 5.4,62.1 6.4,61.1 8.9,61.1 | v14,48.58 14,48.38 12.66,47.04 | 31.8,28.73 36.23,28.73 C43.P$2 38.8,28.9 38.9,29 39.74,29 U$7.5 | U3.17 51.92,40.51 51.92,40.52 53,41.6 53,42 v52.6,42.4 | U2.54 77.68,31.25 C14.2 76.43,30.17 v77.2,29.4 | v77.3,26.1 75.7,26.1 75.3,25.7 U$1.G2 | X4.2 11.39,6.81 14.3,3.9 16.05,3.9 C4.2 27.25,3.95 v28.8,5.5 | v26.2,9.5 27.35,9.9 C7.2 | C11.1 54.75,18.05 56.6,19.9 C29.P$2 | v51.2,43.8 51.2,43.78 U3.10 | U$2.MT2 88.53,2.07 v88.5,2.1 | v82.8,2.3 79.81,2.3 U$2.MT1 | U3.55 63.44,43.32 63.44,43.7 | 63.44,43.7 63.66,43.92 63.99,43.92 64.07,44 64.49,44 U3.58 | 63.44,43.7 63.25,43.7 63.1,43.55 62.4,43.55 60.2,45.75 59.6,46.88 59.38,47.1 59.1,47.2 v58.33,47.87 57.93,47.47 57.93,47.26 57.8,47.13 57.8,45.7 61.56,41.94 61.56,41.25 U3.48
  Top 0.203: v71.3,51.8 72.3,51.7 76.5,55.9 76.5,57.77 83.2,64.47 83.2,64.5 83.19,64.51 83.19,67.85 83.8,68.46 v83.8,68.5 | U3.80 62.59,51.19 | v60.97,48.8 60.97,49.6 U3.80 | U2.12 92.77,42.33 v94.5,40.6
  Bottom 0.203: C20.2 83.12,45.6 v81.5,45.6 80.91,45.01 80.81,43.28 82.5,41.59 82.6,41.3 82.67,41.23 82.67,39.84 82.54,39.71 v82.41,39.71 | C13.1 50.91,43.31 51.4,43.8 | C9.1 44.67,45.33 v43.2,46.8 | 51.77,48.13 v52.25,48.39 | v32.3,66 R12.2 32.3,62.5 v28.1,62.5 28.1,61.4 v29.4,60.55 | v80,55.7 80,55.8 80.3,56.1 80.65,56.1 81.49,56.94 82.49,56.94 C33.2 | C26.2 88.93,36.63 v89.4,37.1 | C21.2 82.73,34.57 v82.3,35 | v28.6,50.8 28.69,50.8 v30.02,49.47 | v30.3,41.7 24.7,41.7 v24.3,43.1 | v19.2,39 19.2,39.2 | v13.35,50.7 13.35,49.23 v14,48.58 | 77.2,26.2 v77.3,26.1 | v28.8,5.5 28.8,6.6 v26.2,9.5 | v39.8,22.2 39.8,22.3 39.2,22.9 | v52.6,42.4 v51.2,43.8 | v88.5,2.1 83,2.1 v82.8,2.3 | v47.7,75.7 47.7,72.2 v43,67.5 | C36.2 57.93,47.26 v58.33,47.87 58.86,48 59.6,48 60.43,48.06 v60.97,48.8 | C35.2 69.53,50.03 v71.3,51.8 | v83.8,68.5 72.7,68.2 72.3,68.3 | 87.5,52.9 87.5,51.3 C28.2 | v94.5,40.6 94.8,40.6 98.7,44.5 v98.8,48.9
  pour Bottom: 0,0 0,87.38 104.14,87.38 104.14,0
HDMI_CLK  (via drill 0.6)
  Top 0.203: U1.6 36.42,55.98 38,54.4 38.5,54.4 38.6,54.3 39.6,54.3 41.2,52.7 41.2,51.1 46.3,46 50.8,46 v52.8,43.82 | U3.42 59.54,39.9 v58.7,39.9
  Bottom 0.203: v58.7,39.9 56.8,39.9 52.8,43.72 v52.8,43.82
HDMI_D0  (via drill 0.51)
  Top 0.203: U3.127 45.15,49.76 v44.38,49.76 | U1.2 39,68 39,56.99 v38.71,56.7
  Bottom 0.203: v44.38,49.76 43.9,50.2 v38.71,56.7
HDMI_D1
  Top 0.203: U1.78 42.38,65.29 49.88,57.79 49.88,55.89 50.54,55.23 50.54,55.11 U3.108 | U3.108
HDMI_D2
  Top 0.203: U3.109 52.73,52.37 51.03,54.07 51.03,54.09 49.32,55.8 49.32,57.66 42.3,64.68 41.16,64.68 U1.77 41.18,64.7
HDMI_D3
  Top 0.203: U3.110 50.54,53.96 50.54,54.01 48.81,55.74 48.81,57.54 42.3,64.05 41.17,64.05 U1.76 41.19,64.07
HDMI_D4
  Top 0.203: U3.111 52.17,51.8 50.04,53.93 50.04,53.96 48.29,55.71 48.29,57.41 42.38,63.32 41.14,63.32 U1.75
HDMI_D5
  Top 0.203: U3.112 51.88,51.54 49.52,53.9 48.66,53.9 47.85,54.71 47.85,57.21 42.31,62.75 41.16,62.75 U1.74
HDMI_D6
  Top 0.203: U3.116 50.75,50.4 48.92,52.23 48.51,52.23 47.39,53.35 47.39,57.02 42.34,62.07 41.14,62.07 U1.73 41.16,62.09
HDMI_D7
  Top 0.203: U3.118 50.17,49.81 48.16,51.83 48.16,51.87 46.89,53.14 46.89,56.98 42.47,61.4 41.13,61.4 U1.72 41.15,61.41
HDMI_D8
  Top 0.203: U3.119 49.91,49.54 47.67,51.78 47.67,51.83 46.54,52.96 46.54,56.76 42.55,60.75 U1.71 | U1.71 | U1.71
HDMI_D9
  Top 0.203: U3.120 49.62,49.26 46.12,52.76 46.12,56.55 42.61,60.06 41.15,60.06 U1.70 41.14,60.07
HDMI_D10
  Top 0.203: U3.121 46.64,51.66 46.63,51.66 45.71,52.58 45.71,56.41 42.67,59.45 U1.69 41.13,59.47
HDMI_D11
  Top 0.203: U3.123 48.77,48.46 45.95,51.28 45.92,51.28 45.17,52.03 45.17,56.33 42.7,58.8 U1.68 41.15,58.82
HDMI_D12
  Top 0.203: U3.124 44.7,51.9 44.7,56.16 43.2,57.66 43.2,57.67 42.72,58.15 41.14,58.15 U1.67
HDMI_D13
  Top 0.203: U3.125 44.83,51.19 44.82,51.19 44.25,51.76 44.25,55.86 42.61,57.5 U1.66
HDMI_D14
  Top 0.203: U3.126 44.32,51.14 44.32,51.16 43.74,51.74 43.74,55.6 42.5,56.84 U1.65
HDMI_D15
  Top 0.203: U3.3 47.88,44.48 46.8,43.4 45,43.4 38.4,50 38.4,52.78 U1.58
HDMI_D16
  Top 0.203: U1.57 37.72,49.98 44.9,42.8 46.8,42.8 U3.4
HDMI_D17
  Top 0.203: U1.56 37.08,49.92 44.9,42.1 46.68,42.1 U3.5
HDMI_D18
  Top 0.203: U1.55 36.42,49.88 44.9,41.4 46.55,41.4 U3.6
HDMI_D19
  Top 0.203: U1.54 35.79,49.91 44.7,40.8 48.76,40.8 U3.11
HDMI_D20
  Top 0.203: U1.53 35.13,49.87 44.8,40.2 48.73,40.2 U3.12
HDMI_D21
  Top 0.203: U1.52 34.47,49.94 44.8,39.6 48.7,39.6 U3.13
HDMI_D22
  Top 0.203: U1.51 33.83,49.87 44.7,39 48.68,39 U3.14
HDMI_D23
  Top 0.203: U1.50 33.17,49.83 44.6,38.4 48.62,38.4 U3.15
HDMI_DE
  Top 0.203: U1.3 38.36,68.06 38.36,69.47 38.66,69.77 40.58,69.77 41.36,70.55 42.36,70.55 44.16,68.75 44.16,67.13 43.84,66.81 43.83,66.81 43.28,66.26 43.28,65.91 50.4,58.79 50.4,56.4 51.1,55.7 51.1,55.1 53.27,52.92 U3.107
HDMI_INT  (via drill 0.51, 0.51 pad 0.25)
  Top 0.203: U3.106 53.67,53.13 v55.1,51.7 | 26.03,54.4 U1.40 27.08,54.25 27.83,55 v27.9,55
  Bottom 0.203: v55.1,51.7 53.6,50.2 48.6,50.2 42.89,57.86 38.05,57.93 36.92,55.37 36.79,55.16 36.5,54.2 28.7,54.2 v27.9,55
N$1  (via drill 0.51)
  Top 0.203: U$3.P$19 15.48,64.92 16.4,64 U1.25 v28.6,64
  Bottom 0.203: R12.1 28.73,64.13 v28.6,64
N$2
  Top 0.203: R1.1 24.29,65.09 24.5,65.3 U1.23
N$3
  Top 0.203: U1.34 15.17,58.13 14.9,58.4 11.38,58.4 U$3.P$6
N$4
  Top 0.203: U1.30 16.15,60.75 15.3,59.9 11.38,59.9 U$3.P$9
N$5
  Top 0.203: U1.31 16.29,60.09 15.1,58.9 11.38,58.9 U$3.P$7
N$6
  Top 0.203: U$3.P$4 24.72,57.42 24.8,57.5 U1.35
N$7
  Top 0.203: U1.37 15.2,56.2 14.5,56.9 11.38,56.9 U$3.P$3
N$9
  Top 0.203: U1.38 14.76,55.54 14.4,55.9 11.38,55.9 U$3.P$1
N$10
  Top 0.203: U1.28 16.65,62.05 15,60.4 11.38,60.4 U$3.P$10
N$11
  Top 0.203: U$1.35 55.04,11.91 C8.2
N$12
  Top 0.203: U$1.31 59.1,16.7 58.75,16.35 C10.1 C11.2 52.85,16.3 51,16.3 49.5,14.8 R3.1
N$13  (via drill 0.51 pad 0.25)
  Top 0.203: v47.5,9.4 47.5,11.95 R3.2 C8.1 | X4.1 6.69,2.8 13.8,2.8 15.9,0.7 27.5,0.7 28,1.2 v30.8,1.2
  Bottom 0.203: v30.8,1.2 41.1,1.2 42.7,2.8 42.7,5.6 46.5,9.4 v47.5,9.4
N$14
  Top 0.203: S1.1 S1.2
  Bottom 0.203: S1.1 89.48,23.58 86.9,21 86.1,21 83.9,23.2 83.9,24.47 R6.2
N$15  (via drill 0.6)
  Top 0.203: U$1.40 63.91,5.91 65.2,7.2 v69.8,7.2 | v77,7.2 78.2,8.4 78.2,17 88.8,27.6 93.6,27.6 101.3,35.3 101.3,61.97 98.34,64.93 R13.2
  Bottom 0.203: v77,7.2 v69.8,7.2
N$16  (via drill 0.51 pad 0.25)
  Top 0.203: R5.2 17.85,74.55 v17.6,74.8 | v4.1,31.6 4.1,29.2 4.5,28.8 4.5,27.2 2.2,24.9 2.2,24.3 3.2,23.3 4,23.3 15.7,11.6 15.7,9.6 17.2,8.3 17.3,8.2 30.2,8.2 30.2,5.7 34.1,1.8 v43.8,1.8 | U$1.39 61.69,7.13 60.44,7.13 60.07,7.5 v49,7.5
  Bottom 0.203: v17.6,74.8 17.5,74.8 14.2,78.1 13.3,78.1 7.1,71.9 7.1,39.6 4.8,37.3 4.8,32.3 v4.1,31.6 | v49,7.5 46.4,7.5 43.8,4.9 v43.8,1.8
N$17  (via drill 0.51 pad 0.25)
  Top 0.203: v79.8,13.7 78.7,14.8 78.7,16.7 88.9,26.9 93.7,26.9 101.8,35 101.8,63.1 v100.5,64.4 | v65.4,8.5 61.52,8.5 U$1.38 | v94.86,64.4 R2.2
  Bottom 0.203: v79.8,13.7 79.6,13.7 78.1,12.2 69.1,12.2 v65.4,8.5 | v100.5,64.4 v94.86,64.4
N$18  (via drill 0.51 pad 0.25)
  Top 0.203: R14.2 14.27,75.73 v13.3,76.4 | v5.5,31.9 9,31.9 10.6,30.3 16.7,30.3 18.3,28.7 18.3,27.1 17.8,26.6 17.8,11.1 18.5,10.4 18.5,8.8 18.6,8.7 42.3,8.7 42.5,8.5 v43.5,9.3 | v51,9.5 U$1.37
  Bottom 0.203: v5.5,31.9 5.3,32.1 5.3,37.1 7.7,39.5 7.7,71.7 8.6,71.7 v13.3,76.4 | v43.5,9.3 43.6,9.3 45,10.7 49.8,10.7 v51,9.5
N$19
  Top 0.203: R23.2 65.18,73.77 X6.4
N$20
  Top 0.203: U1.27 16.61,62.71 14.8,60.9 11.38,60.9 U$3.P$11
N$21  (via drill 0.51 pad 0.25)
  Top 0.203: U5.4 12.6,44.1 11.4,42.9 11.4,41 12.3,40.1 12.3,38.73 C30.1 12.4,38.1 13.7,36.8 18.47,36.8 R9.1 18.6,35.7 18,35.1 v18,33.6 | U4.VBUS 48.74,6.16 43.3,11.6 33.5,11.6 v28.1,17 | v18.8,26.2 18.8,30.9 v19,31.1
  Bottom 0.203: v28.1,17 28,17 v18.8,26.2 | v19,31.1 19,32.6 v18,33.6
N$22  (via drill 0.51 pad 0.25)
  Top 0.203: v38.5,15.9 38.5,18.25 R15.2
  Bottom 0.203: U$5.P$4 19.75,11.35 20.6,12.2 34.8,12.2 v38.5,15.9
N$23  (via drill 0.51 pad 0.25, 0.6, 0.6 pad 0.25)
  Top 0.203: U3.115 51.82,49.88 51.82,49.13 51.24,48.55 51.24,47.68 51.26,47.46 v51.36,47.36 | v55.98,49.54 55.98,49.44 v53.92,47.38 | U3.87 59.66,52.24 59.05,52.24 v58.05,51.24
  Bottom 0.203: C9.2 48.22,46.53 C12.2 48.62,45.47 47.6,44.45 47.6,44.3 | C15.2 52.95,45.67 51.57,45.67 50.2,44.3 47.6,44.3 | v53.92,47.38 53.92,46.39 C15.2 | C15.2 52.99,46.3 51.78,46.3 51.48,46.6 51.48,47.24 v51.36,47.36 | 47.6,44.3 46.5,43.2 46.07,43.2 C13.2 | v58.05,51.24 57.68,51.24 v55.98,49.54
N$24  (via drill 0.6)
  Top 0.203: C29.P$1 53.99,22.69 54.7,23.4 54.7,25.99 R7.1 55.82,26.02 v56.3,26.5 | v76.6,14.8 76.6,16.6 80.1,20.1 80.1,24.6 v81.6,26.1 80.6,26.1 79.52,25.02 79.52,23.62 79.26,23.36 v78.52,23.36 | U3.70 70.86,53.84 72.87,53.84 v73.18,53.85 | v76.23,50.66 76.2,50.56 75.31,49.47 75.31,48.81 75,48.5 75,47.1 74.5,46.6 74.5,44.6 74.4,44.6 72.6,42.8 72.6,42.15 72.62,42.13 72.62,30.36 v73.67,29.51
  Bottom 0.203: v56.3,26.5 57.4,26.5 69.9,14 75.8,14 v76.6,14.8 | v81.6,26.1 83.71,26.1 R6.1 | v73.18,53.85 73.77,53.25 75.66,51.46 76.46,50.89 v76.23,50.66 | v73.67,29.51 73.67,28.21 v78.52,23.36
N$25
  Top 0.203: 68.76,56.39 C38.1 | R10.1 66.66,58.76 67.6,59.3 68.2,59.2 68.9,58.7 69.4,58 69.19,56.84 C38.1 | C38.1 68.91,55.91 68.08,55.91 Y1.P$1
N$26
  Top 0.203: U5.5 13.05,41.2 R8.2
N$27
  Top 0.203: U3.88 62.88,56.04 Y1.P$2 61.91,58.14 C39.1
N$28  (via drill 0.6)
  Top 0.203: U$1.36 v64.2,10.7
  Bottom 0.203: v64.2,10.7 R16.2
N$29  (via drill 0.51)
  Top 0.203: v64,60.4 64.74,60.4 R10.2 | U3.89 61.4,55.14 61.4,55.87 60.83,56.44 60.83,57.07 v60.8,57.1
  Bottom 0.203: v64,60.4 63.6,60.3 v60.8,57.1
N$30
  Top 0.203: R14.1 13.57,72.03 11.9,73.7 11.9,78.4 10.3,80 7.01,80 X3.2
N$31
  Top 0.203: X2.2 R2.1
N$32
  Top 0.203: R5.1 14.12,68.93 X3.1
N$33
  Top 0.203: X2.1 96.97,76.43 98.34,75.06 R13.1
N$34
  Top 0.203: D1.A 18.48,43.32 20.3,41.5 R9.2
N$35  (via drill 0.51 pad 0.25)
  Top 0.203: U5.1 16.2,42.2 v17.1,41.3 | v20.8,44.4 20.8,46.1 19.8,47.1 D1.C
  Bottom 0.203: v17.1,41.3 17.7,41.3 v20.8,44.4
N$38
  Bottom 0.203: IC2.4 5.15,29.35 7,31.2 9.1,31.2 10.1,30.2 10.1,25 10.8,24.3 12.4,24.3 13.1,25 IC3.2
N$40
  Bottom 0.203: R18.1 7.55,15.95 9.15,13.53 12.3,13.53 C47.1 14.05,15.9 15.7,15.9 16.5,16.7 16.5,18.7 14.05,21.15 IC3.1
N$41  (via drill 0.51 pad 0.25)
  Top 0.203: v24.2,7.4 v29.3,7.4 | v31.8,7.4 33.6,5.6 36.02,5.6 X8.2
  Bottom 0.203: C47.2 R19.2 8.35,19.9 6,19.9 4,17.9 R17.2 4.25,17.4 5.3,17.4 6,16.7 6,14.4 10.1,10.3 11.2,10.3 13.4,8.1 16.3,8.1 17,7.4 v24.2,7.4 | v29.3,7.4 v31.8,7.4
N$42  (via drill 0.51 pad 0.25)
  Top 0.203: U5.3 15.65,47.45 16.8,48.6 19.4,48.6 | 19.4,48.6 22.2,45.8 22.2,42.9 20.9,41.6 20.9,39 21.1,38.8 | 21.1,38.8 C37.1 22.74,38.5 v24.7,38.5 | v38.5,35.2 41.6,32.1 41.6,28.3 41,27.7 39.85,27.7 U$7.7 | 33.09,40.3 R20.2 | R20.2 33.34,40.36 30.8,42.9 30.8,46.6 C48.1 | 19.4,48.6 v21.6,48.6 | v22,74.9 21.7,80.48 X5.1 | 21.1,38.8 21.1,38.14 21.42,37.82 21.42,35.83 v24.6,32.65 | v29.85,29.1 29.2,29.1 v25.78,26.38 | v25.55,24.51 24.96,24.51 v19.72,19.27 | v10.34,12.58 10.34,14.08 v10.61,14.35 | v30.5,39.9 33.19,39.9 R20.2
  Bottom 0.203: R18.2 8.9,17.65 R19.1 v10.61,14.35 | v38.5,35.2 35.2,35.2 v30.5,39.9 28.7,38.1 25.1,38.1 v24.7,38.5 | v21.6,48.6 21.6,52.4 12.1,61.9 12.4,65.3 v22,74.9 | v24.6,32.65 26.3,32.65 v29.85,29.1 | v19.72,19.27 19.65,19.27 12.73,12.35 10.57,12.35 v10.34,12.58 | v25.78,26.38 25.78,24.74 v25.55,24.51
N$43
  Bottom 0.203: IC2.1 8.55,24.91 C50.2 5.9,22.3 2.5,18.9 2.5,16.2 2.8,15.9 3.95,15.9 R17.1
N$49  (via drill 0.51 pad 0.25)
  Top 0.203: C49.2 34.66,40.43 R20.1 37.75,40.05 v44,33.8 | v39.4,25.4 39.4,26.7 U$7.8
  Bottom 0.203: v44,33.8 44,30 v39.4,25.4
N$50
  Top 0.203: U$7.2 42.45,27.75 42.2,28 42.2,33.7 39.1,36.8 35.33,36.8 R21.2
N$51  (via drill 0.51 pad 0.25)
  Top 0.203: X5.2 20.18,70.02 v20.2,70 | v33.9,31.1 34.5,31.1 35.5,32.1 35.5,33.78 R22.2 35.48,33.8 38.3,33.8 41.1,31 41.1,29 40.51,28.41 U$7.6
  Bottom 0.203: v20.2,70 20.2,68 17.8,65.6 14.8,65.6 13.3,64.1 13.3,63.3 13,63 13,62 22.3,52.7 22.3,49.4 23.6,48.1 23.6,43.7 22.1,42.2 22.1,36.9 25.3,33.7 31.3,33.7 v33.9,31.1
N$52  (via drill 0.51, 0.51 pad 0.25)
  Top 0.203: U3.63 67.79,43.5 67.8,43.5 68,43.3 68.4,43.3 v68.8,42.9 | U$2.5 83.34,9.16 v83.3,9.2 | v69,36.4 69,32.6 v69.1,32.5
  Bottom 0.203: v83.3,9.2 83.3,15 74.6,23.7 74.6,24.3 69.1,29.8 v69.1,32.5 | v68.8,42.9 68.8,41.5 68.9,41.4 68.9,36.5 v69,36.4
N$59
  Top 0.203: C10.2 58.75,14.65 59.1,14.3 U$1.33
SD_CD  (via drill 0.51 pad 0.25)
  Top 0.203: 54.7,54.3 U3.102 52.25,56.78 52.25,58.37 52.23,58.39 52.23,58.75 51.99,58.99 51.99,61.18 52.02,61.21 48.16,65.07 46.53,65.07 45.5,66.1 45.5,76.4 48.44,79.34 74.46,79.34 v74.5,79.3 | U$2.CD1 82.58,17.91 82.58,19.92 89,26.34 93.84,26.34 102.3,34.8 102.3,76.5 99.5,79.3 v95,79.3
  Bottom 0.203: v74.5,79.3 v95,79.3
SD_CS  (via drill 0.51)
  Top 0.203: U$2.2 86.64,8.66 84,11.3 81.7,11.3 v81.6,11.2 | v62.7,35.2 61.97,35.2 U3.38
  Bottom 0.203: v62.7,35.2 62.7,33.6 81.6,14.7 v81.6,11.2
SD_IN  (via drill 0.51 pad 0.25)
  Top 0.203: U3.37 59.19,37.37 59.23,37.37 61.2,35.4 61.2,34.87 v61.6,34.47 | v84.58,8.3 85.18,8.3 85.57,7.91 85.57,5.9 U$2.3
  Bottom 0.203: v61.6,34.47 61.95,33.58 81.15,14.38 81.15,11.85 80.09,10.79 80.09,9.45 81.61,7.93 84.21,7.93 v84.58,8.3
SDRAM_0  (via drill 0.51, 0.51 pad 0.25)
  Top 0.203: U2.23 95.97,51.13 97,50.1 v97,41.6 | v93,34.3 91.35,34.3 U2.2 91.29,34.3 85.6,34.3 84.9,33.6 84.3,33.6 78.7,28 72.8,28 72.4,28.4 70.3,28.4 70,28.1 48.6,28.1 46.9,29.8 46.9,34.96 U3.18 52.13,40.23
  Bottom 0.203: v93,34.3 93,36.1 97,40.1 v97,41.6
SDRAM_1  (via drill 0.51, 0.51 pad 0.25)
  Top 0.203: 91.39,36 U2.4 92.39,35.93 92.52,35.8 v94.8,35.8 94.8,35.4 95.4,34.8 95.4,34.1 93.8,32.5 84.4,32.5 79.3,27.4 v70,27.4 | U3.19 52.46,39.96 v53.9,41.5 | v97.9,40.9 97.9,51.34 97.38,51.86 91.39,51.86 U2.24
  Bottom 0.203: v70,27.4 64,33.2 64,35.2 63.1,36.1 62.4,36.1 61.4,35.6 60.8,35.8 59.9,36.7 59.4,36.7 56.3,39.8 56.2,39.8 54.5,41.5 v53.9,41.5 | v97.9,40.9 97.9,39.7 97.8,39.7 95.1,37 95.1,36.1 v94.8,35.8
SDRAM_2  (via drill 0.51, 0.51 pad 0.25)
  Top 0.203: U2.5 91.35,36.7 v96.2,36.7 96.6,36.3 96.6,34.3 94.3,32 84.5,32 79.4,26.9 70.7,26.9 70.4,26.6 69.5,26.6 69,27.1 v66.6,27.1 | U3.20 52.77,39.67 53.6,40.5 54.3,40.5 v54.5,40.3 | U2.25 98.9,52.73 99.57,52.06 99.57,41.13 v99.6,41.1
  Bottom 0.203: v66.6,27.1 56.2,37.5 56.2,38.8 54.7,40.3 v54.5,40.3 | v96.2,36.7 99.6,40.1 v99.6,41.1
SDRAM_3
  Top 0.203: 91.39,38.4 U2.7 | U2.7 91.37,38.28 92.24,38.28 92.69,38.73 99.73,38.73 100.8,39.8 100.8,52.2 99.47,53.53 U2.26 | U3.21 53.01,39.32 52.11,38.42 51.07,38.42 47.49,34.84 47.49,33.86 47.4,33.77 47.4,30.1 48.91,28.59 69.79,28.59 70.2,29 72.71,29 73.12,28.59 78.65,28.59 78.66,28.6 88.4,38.3 91.29,38.3 U2.7
SDRAM_4  (via drill 0.51, 0.51 pad 0.25)
  Top 0.203: v85.2,51.5 83.5,53.5 81.57,53.53 U2.29 79.17,53.53 78.6,54.1 77.76,54.1 74.1,50.44 74.1,48.9 73.8,48.6 73.8,47.9 73.5,47.6 73.5,45.1 71.7,43.3 71.7,32 69.2,29.5 50.9,29.5 48.5,31.9 48.5,34.8 48.51,35.09 48.51,35.2 51.22,37.91 52.12,37.91 U3.22 | 91.29,39.1 U2.8 87.63,39.13 v87.6,39.1
  Bottom 0.203: v85.2,51.5 85.2,41 87.1,39.1 v87.6,39.1
SDRAM_5  (via drill 0.51, 0.51 pad 0.25)
  Top 0.203: U2.30 80.67,52.73 86,47.7 86.4,47.7 86.9,47.2 86.9,44.9 v86.4,44.4 | v88.4,40.7 91.29,40.7 U2.10 91.35,40.7 v93,40.7 | U3.23 53.57,38.77 52.1,37.4 51.9,37.3 v51.4,36.8 | v76.5,17.6 76.8,17.9 76.8,23.6 84.8,31.4 94.6,31.4 97.2,34 97.2,37.1 96.5,37.8 v93,37.8
  Bottom 0.203: v86.4,44.4 86.4,42.7 v88.4,40.7 | v76.5,17.6 73.4,14.5 70.2,14.5 55.6,29.1 55.6,30.1 52.74,32.96 52.74,32.97 52.7,33.01 52.7,34.2 51.4,35.5 v51.4,36.8 | v93,37.8 v93,40.7
SDRAM_6  (via drill 0.51, 0.51 pad 0.25, 0.6)
  Top 0.203: v86.1,46.7 80.87,51.93 U2.31 79.07,51.93 78.1,52.9 77.2,52.9 74.6,50.3 74.6,48.7 74.3,48.4 74.3,47.4 74,47.1 74,44.9 72.2,43.1 72.2,31.7 69.9,29.4 69.7,29.4 69.3,29 50,29 v49.1,29.9 | U2.11 91.29,41.5 90.3,41.5 89.8,42 89.8,44 v89,44.8 | U3.24 53.84,38.54 52.3,37 52.3,36.6 51.7,36 50.8,36 50.6,36.2 50.2,36.2 49,35 49,33.6 49.3,33.3 50,33.3 50.68,32.62 v51.25,32.62
  Bottom 0.203: v86.1,46.7 87.9,46.7 88.2,46.4 88.2,45.6 v89,44.8 | v49.1,29.9 51.25,32.05 v51.25,32.62
SDRAM_7  (via drill 0.51, 0.51 pad 0.25)
  Top 0.203: U2.32 79.93,51.1 78.5,51.1 v78.1,51.4 77.2,50.5 77.2,50.03 v76.56,49.39 | v80.8,57.9 80.8,60.61 82.79,62.6 v92.4,62.6 | U3.25 54.14,38.22 54.12,38.22 | 54.12,38.22 54.06,38.22 | 54.12,38.22 52.7,36.8 52.7,36.4 51.9,35.6 50.3,35.6 49.7,35 49.7,34.3 50.3,33.7 51.89,33.7 53.2,32.39 53.23,32.39 54.34,31.28 60.61,31.28 65.7,36.37 65.7,37.6 65.83,37.73 68.93,37.73 71.24,40.04 71.24,44.29 73,46.05 73,47.7 73.13,47.83 v73.13,48.96 | U2.13 93.17,43.13 v94.5,41.8
  Bottom 0.203: v73.13,48.96 73.13,49.08 73.82,49.77 76.24,49.37 v76.56,49.39 | v94.5,41.8 98,45.3 98,61.2 96.6,62.6 v92.4,62.6 | v78.1,51.4 78.9,52.2 78.9,56.4 80.4,57.9 v80.8,57.9
SDRAM_8  (via drill 0.51, 0.51 pad 0.25)
  Top 0.203: U2.33 78.83,50.33 v78.7,50.2 | U2.42 79.93,43.1 79.3,43.1 v78.8,43.2 77.7,42.4 76.1,41.3 76.1,40.6 76,40.5 v76,39.5 | U3.40 61.3,37 61.3,36.99 61.77,36.52 62.5,36.52 63.21,37.23 63.21,37.4 63.48,37.67 64,37.67 v64.02,37.69
  Bottom 0.203: v78.7,50.2 78.7,47.9 79.5,47.1 79.5,44.6 v78.8,43.2 | v64.02,37.69 66.9,35.5 69.5,35.5 69.7,35.7 73.2,39.5 v76,39.5
SDRAM_9  (via drill 0.51)
  Top 0.203: U2.34 79.99,49.5 82.6,49.5 84.6,47.5 84.6,42.1 84,41.5 81.5,41.5 v81.4,41.6 81.33,41.53 U2.44 | U3.41 60.36,38.54 61.2,37.7 61.7,37.7 v62.1,37.3
  Bottom 0.203: v81.4,41.6 81.4,36.9 77.9,33.4 76.8,33.4 v75.7,34.5 v75.69,34.49 74.83,34.49 74.61,34.27 65.76,34.27 62.73,37.3 v62.1,37.3
SDRAM_10  (via drill 0.51, 0.51 pad 0.25)
  Top 0.203: U2.22 90.33,50.33 87.4,47.3 87.4,43.9 84,40.6 80.09,40.6 U2.45 77.31,40.2 v76.88,40.23 | U3.50 63.61,40.4 63.95,40.07 64.99,40.07 v65.23,40.31 | v66.93,39.87 69.17,39.87 v69.7,40.4
  Bottom 0.203: v69.7,40.4 71.5,40.4 71.9,40.1 74.4,40.1 74.5,40.2 74.8,40.4 76.71,40.4 v76.88,40.23 | v65.23,40.31 66.49,40.31 v66.93,39.87
SDRAM_11  (via drill 0.51, 0.51 pad 0.25)
  Top 0.203: U2.47 78.43,39.13 v78.4,39.1 77.8,38.5 75.5,38.5 75.1,38.9 75.1,39.8 75.3,40 v75.3,41.3 | U2.35 79.93,48.7 78.6,48.7 v77.9,48 | U3.49 62.62,40.8 62.62,40.78 63.8,39.6 64.42,39.6 v64.72,39.3 | v66.95,38.48 68.88,38.48 70.5,40.1 v70.5,41.5
  Bottom 0.203: v70.5,41.5 70.6,41.8 71.3,41.8 72.1,40.9 74.6,40.9 75.1,41.3 v75.3,41.3 | v78.4,39.1 78.37,39.13 78.37,39.86 78.22,40.11 78.22,40.83 76.9,42.05 76.9,43.7 78.9,45.7 78.9,47.1 78,48 v77.9,48 | v66.95,38.48 66.84,38.37 65.61,38.37 64.72,39.26 v64.72,39.3
SDRAM_12  (via drill 0.51)
  Top 0.203: U2.36 83.07,47.93 v83.6,47.2 | v82.8,38.4 80.03,38.4 U2.48 | U3.75 70.9,56.7 70.9,63.6 v71.1,63.8 | v84,50.7 84.6,50.7 84.9,50.4 85.8,50.4 86.2,50.8 86.2,56.4 84.7,57.9 84.7,59.3 v84,60
  Bottom 0.203: v82.8,38.4 84.7,40.3 84.7,46.7 84.2,47.2 v83.6,47.2 83.9,47.5 v84,50.7 | v71.1,63.8 71.7,63.8 72.1,64.2 79.8,64.2 v84,60
SDRAM_13  (via drill 0.51)
  Top 0.203: U2.20 89.73,48.73 88,47 88,42.3 85.16,39.46 85.16,37.45 84.29,36.58 82.22,36.58 82.1,36.7 79.99,36.7 U2.50 79.89,36.8 77.14,36.8 76.66,36.32 75.88,36.32 73.7,38.5 v73.7,41.7 | v64.5,45.5 62.5,47.2 62.5,48.77 U3.76
  Bottom 0.203: v73.7,41.7 72.1,41.7 68.3,45.5 v64.5,45.5
SDRAM_14  (via drill 0.51)
  Top 0.203: U2.21 94.87,49.53 95.5,49.1 95.5,43.9 95.4,43.8 v94.8,43.8 | v89,43 89,42.63 85.72,39.35 85.72,37.2 84.41,35.89 82.21,35.89 82.2,35.9 79.99,35.9 U2.51 79.93,35.9 78.9,35.9 78.5,35.5 v74.8,35.5 | U3.77 63.37,50.37 62.5,49.5 62.1,49.5 v62,49.4 | v58.7,46.1 v61.7,43.1
  Bottom 0.203: v61.7,43.1 61.31,39.34 65.85,34.8 74.1,34.8 v74.8,35.5 | v58.7,46.1 59.62,46.1 62.01,48.49 v62.01,49.39 v62,49.4 | v94.8,43.8 89.8,43.8 v89,43
SDRAM_15  (via drill 0.51)
  Top 0.203: U3.78 63.16,50.66 64.1,51.6 64.55,51.6 v64.6,51.65 | v77.7,34.3 79.93,34.3 U2.53
  Bottom 0.203: v64.6,51.65 64.88,51.88 71.7,59 71.7,63.1 72,63.4 75.9,63.4 76.1,63.6 77,63.6 77.5,63.1 77.5,58 77.3,57.8 77.3,56.7 77.5,56.5 77.5,52.1 77.2,51.8 77.2,50.7 77.5,50.4 77.5,48.9 76.8,48.2 76.8,45.5 76,43.1 76,42.23 77.62,40.61 77.62,40.6 77.76,40.46 77.76,39.64 77.8,39.6 77.4,39.2 77.4,34.6 v77.7,34.3
SDRAM_CAS  (via drill 0.51)
  Top 0.203: U3.83 61.66,52.06 60.4,50.8 59.27,50.15 59.27,49.7 v58.67,49.1 | v86,59.2 86.6,59.2 88.6,61.2 90.5,61.2 v95.6,56.1 | v94.7,46.7 92.8,46.7 92.4,46.3 91.35,46.3 U2.17
  Bottom 0.203: v86,59.2 80.4,64.8 70.7,64.8 70.45,64.55 70.45,64.34 68.42,62.31 68.42,56.45 65.28,53.31 63.91,53.31 59.5,48.9 58.87,48.9 v58.67,49.1 | v95.6,56.1 95.6,47.6 v94.7,46.7
SDRAM_CKE  (via drill 0.51)
  Top 0.203: v72.1,47.4 72.1,49.2 79.8,56.9 79.8,59.1 80.1,59.4 80.1,60.6 85,65.5 v85.9,65.5 | U2.37 79.89,47.2 77.3,47.2 76.3,48.2 v75.9,48.2 | U3.104 51.34,56.56 51.34,58.45 51.07,58.72 51.07,59.63 48.87,61.83 48.87,63.03 v48.4,63.5
  Bottom 0.203: v85.9,65.5 84.2,67.2 65.2,67.2 61.9,63.9 51.9,63.9 51.5,63.5 v48.4,63.5 | v72.1,47.4 75.2,47.5 v75.9,48.2
SDRAM_CLK  (via drill 0.51, 0.51 pad 0.25)
  Top 0.203: v75.67,46.59 77.81,46.59 78.1,46.3 79.93,46.3 U2.38 | v71,46.1 71,45.2 70.6,44.8 70.6,42.9 69.5,41.8 68.6,41.8 68,42.4 68,42.75 U3.62
  Bottom 0.203: v71,46.1 75.18,46.1 v75.67,46.59
SDRAM_CS  (via drill 0.51, 0.51 pad 0.25)
  Top 0.203: U2.19 92.93,47.93 v93,48 | 55.39,53.09 54.43,54.05 U3.103 54.41,54.06 51.79,56.68 51.79,58.56 51.55,58.8 51.55,60.25 v50.3,61.5
  Bottom 0.203: v93,48 93,56 82.6,66.4 65,66.4 56.6,58 55.6,58 52.1,61.5 v50.3,61.5
SDRAM_LDQM  (via drill 0.51)
  Top 0.203: v78.2,57.2 77.9,56.5 70.4,49 68.7,47.4 68.1,47.4 66.7,46 66.1,46 64.8,44.7 63.8,44.7 60.1,48.4 60.1,49.3 U3.81 | v97,56.1 91.5,61.8 83.5,61.8 v82.1,60.4 | v94.6,45 94,45 93.7,44.7 91.35,44.7 U2.15
  Bottom 0.203: v82.1,60.4 79.3,57.9 78.9,57.6 78.6,57.6 v78.2,57.2 | v97,56.1 97,47.6 v94.6,45
SDRAM_RAS  (via drill 0.51)
  Top 0.203: v89.4,47.2 91.25,47.2 U2.18 | U3.84 60.24,51.14 59.14,51.14 v58,50 | v92.2,55.7 90.1,57.8 88.7,57.8 87.6,58.9 v87.6,59.1
  Bottom 0.203: v87.6,59.1 81.4,65.3 70.6,65.3 67.8,62.5 67.8,56.51 65.33,54.04 63.75,54.04 63.04,53.33 63.03,53.33 59.4,49.9 58.1,49.9 v58,50 | v92.2,55.7 92.2,50 v89.4,47.2
SDRAM_UDQM  (via drill 0.51)
  Top 0.203: 61.99,51.79 U3.82 59.82,49.59 59.79,49.59 59.6,49.4 59.6,47.6 v62.8,44.4 62.73,44.47 | U2.39 79.93,45.5 77.2,45.5 v74.9,43.2
  Bottom 0.203: v74.9,43.2 74.5,42.8 73.7,42.8 73.4,42.5 72.2,42.5 68.7,46 65.8,46 65.5,46.3 64.2,46.3 62.9,45 62.9,44.5 v62.8,44.4
SDRAM_WE  (via drill 0.51)
  Top 0.203: 91.35,45.5 U2.16 91.39,45.6 v93.3,45.6 | U3.92 59.19,54.59 v58,53.4 | v89,58.8 91.2,58.8 v93.9,56
  Bottom 0.203: v58,53.4 58,52.7 58.3,52.4 58.7,52.4 60.3,54 60.3,56.3 60,56.6 60,57.7 63.4,61.1 64.3,61.2 64.6,61.5 64.6,64.7 65.8,65.9 82.3,65.9 85.4,62.8 85.4,62.4 v89,58.8 | v93.9,56 93.9,46.4 v93.3,45.6
SWCLK
  Top 0.203: U3.100 55.28,54.92 54.1,56.1 54.1,66.8 53.9,67 53.7,67.2 53,67.9 53,70.12 X1.4
TDI  (via drill 0.51)
  Top 0.203: U3.98 55,56.29 55,63.8 55.4,64.2 v55.4,65.5 | v50.7,65.2 50.7,67.25 50.46,67.49 50.46,70.12 X1.8
  Bottom 0.203: v55.4,65.5 53.23,65.5 52.94,65.21 v50.71,65.21 v50.7,65.2
TDO_SWO  (via drill 0.51)
  Top 0.203: U3.97 55.4,56.47 55.4,58.1 v56.8,59.5 | v52.2,62.9 52.2,67.27 51.76,67.71 X1.6
  Bottom 0.203: v56.8,59.5 55.6,59.5 v52.2,62.9
TMS_SWDIO
  Top 0.203: U3.99 55.51,55.19 54.49,56.21 54.49,69.94 X1.2
VCC  (via drill 0.51 pad 0.25)
  Top 0.203: v8.6,29.3 11.3,29.3 13.2,27.4 15.1,27.4 v16.5,28.8
  Bottom 0.203: IC2.5 8.3,29 v8.6,29.3 | v16.5,28.8 IC3.5

## Text on the board
tPlace: ECE477 Group 12 | V1.0 | 3/13/2015